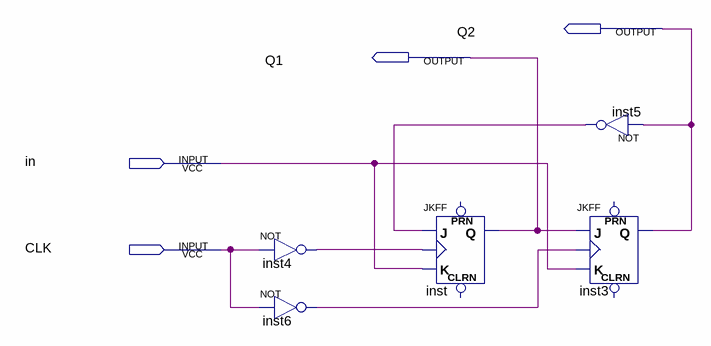
[diagram p0: schematic sheet]
// Quartus schematic ex2-2.bdf as structural Verilog: 5 symbols, 4 pins
module \ex2-2  (
  input  in,
  input  CLK,
  output Q2,
  output Q1
);

  wire inst4_out, inst5_out, inst6_out;

  not inst4 (inst4_out, CLK);
  not inst6 (inst6_out, CLK);
  JKFF inst (.K(in), .J(inst5_out), .CLK(inst4_out), .Q(Q1));  // open: PRN, CLRN
  not inst5 (inst5_out, Q2);
  JKFF inst3 (.K(in), .J(Q1), .CLK(inst6_out), .Q(Q2));  // open: PRN, CLRN
endmodule
